# Altium schematic sheet main.SchDoc: uSD Card Module - Main
size A4; Author: mayerph; DrawnBy: mayerph; Organization: IIS; Revision: PA; SheetNumber: 1; SheetTotal: 3
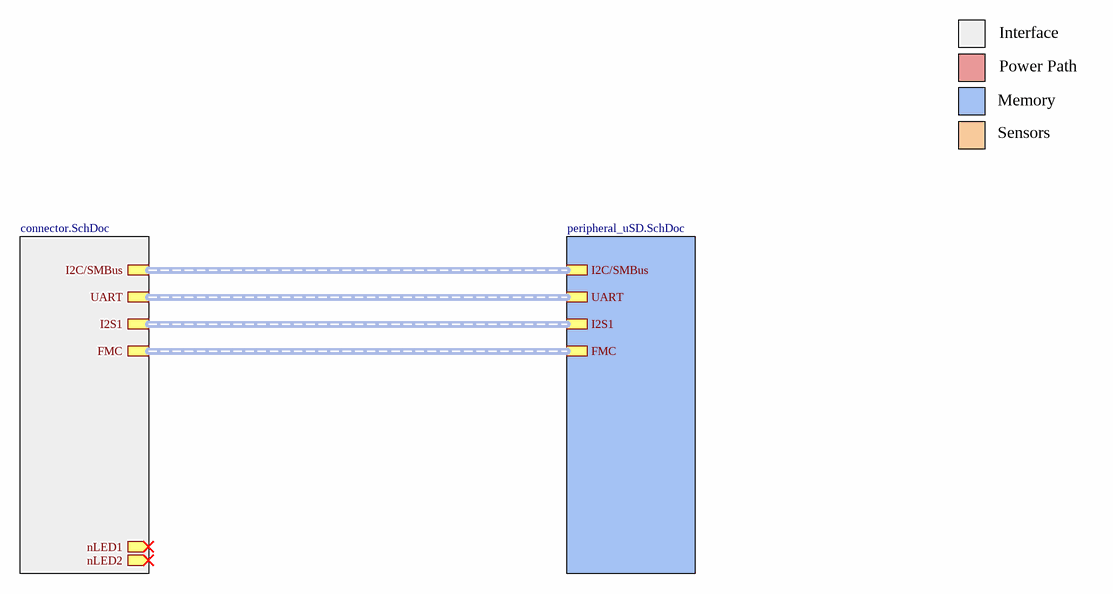
[diagram p0: main.SchDoc]

## Sub-sheets
connector = connector.SchDoc: UART (harness UART), nLED1 (out), I2C/SMBus (harness I2C/SMBus), I2S1 (harness I2S1), nLED2 (out), FMC (harness FMC)
peripheral = peripheral_uSD.SchDoc: I2C/SMBus, UART, I2S1, FMC

## Buses and harness runs
harness sheet connector/FMC = sheet peripheral/FMC
harness sheet connector/I2C/SMBus = sheet peripheral/I2C/SMBus
harness sheet connector/I2S1 = sheet peripheral/I2S1
harness sheet connector/UART = sheet peripheral/UART

## Notes on the sheet
- Interface
- Memory
- Power Path
- Sensors
- 1
- 2
- 3
- 4
- A
- B
- C
- Project:
- D
- Date:
- Drawing number:
- Rev:
- Format:
- A4 Q
- Drawn by:
- Laboratory:
- Page
- Sheet:
- of
- File: